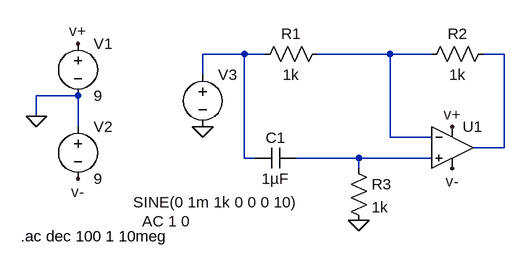
[diagram p0: schematic ej7_tp1.asc]
ej7_tp1.asc, the LTspice schematic file:
Version 4
SHEET 1 880 680
WIRE 16 112 -48 112
WIRE 48 112 16 112
WIRE 240 112 128 112
WIRE 304 112 240 112
WIRE 416 112 384 112
WIRE -48 144 -48 112
WIRE -240 176 -304 176
WIRE -304 208 -304 176
WIRE -240 224 -240 176
WIRE 240 240 240 112
WIRE 304 240 240 240
WIRE 416 256 416 112
WIRE 416 256 368 256
WIRE 16 272 16 112
WIRE 32 272 16 272
WIRE 192 272 96 272
WIRE 304 272 192 272
WIRE 192 288 192 272
FLAG -48 224 0
FLAG 192 368 0
FLAG -304 208 0
FLAG -240 96 v+
FLAG -240 304 v-
FLAG 336 224 v+
FLAG 336 288 v-
SYMBOL res 32 128 R270
WINDOW 0 32 56 VTop 2
WINDOW 3 0 56 VBottom 2
SYMATTR InstName R1
SYMATTR Value 1k
SYMBOL res 288 128 R270
WINDOW 0 32 56 VTop 2
WINDOW 3 0 56 VBottom 2
SYMATTR InstName R2
SYMATTR Value 1k
SYMBOL res 176 272 R0
SYMATTR InstName R3
SYMATTR Value 1k
SYMBOL cap 96 256 R90
WINDOW 0 0 32 VBottom 2
WINDOW 3 32 32 VTop 2
SYMATTR InstName C1
SYMATTR Value 1µF
SYMBOL voltage -240 80 R0
SYMATTR InstName V1
SYMATTR Value 9
SYMBOL voltage -240 208 R0
SYMATTR InstName V2
SYMATTR Value 9
SYMBOL voltage -48 128 R0
WINDOW 3 -107 212 Left 2
WINDOW 123 -93 241 Left 2
WINDOW 39 0 0 Left 0
SYMATTR Value SINE(0 1m 1k 0 0 0 10)
SYMATTR Value2 AC 1 0
SYMATTR InstName V3
SYMBOL Opamps\\UniversalOpamp2 336 256 R0
SYMATTR InstName U1
TEXT -328 392 Left 2 !.ac dec 100 1 10meg

The netlist it stands for:
* ej7_tp1.asc
R1 N001 N002 1k
R2 N002 N003 1k
R3 N004 0 1k
C1 N004 N001 1µF
V1 v+ 0 9
V2 0 v- 9
V3 N001 0 SINE(0 1m 1k 0 0 0 10) AC 1 0
XU1 N004 N002 v+ v- N003 level.2 Avol=1Meg GBW=10Meg Slew=10Meg ilimit=25m rail=0 Vos=0 phimargin=45 en=0 enk=0 in=0 ink=0 Rin=500Meg  ; pins IN+ IN- V+ V- OUT
.ac dec 100 1 10meg
.lib UniversalOpamps2.sub
.backanno
.end